# Altium schematic sheet power_mux.SchDoc
size A4; SheetNumber: 8; SheetTotal: 8
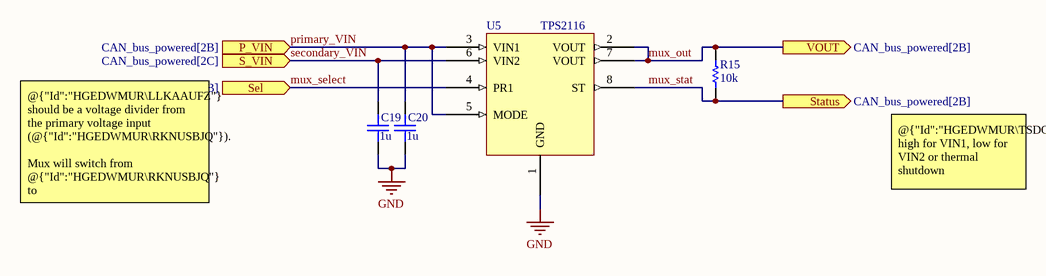
[diagram p0: power_mux.SchDoc]

## Parts
C19  1u
C20  1u
R15  10k
U5  TPS2116

## Ports
P_VIN (in, see CAN_bus_powered[2B]), S_VIN (in, see CAN_bus_powered[2C]), Sel (in, see CAN_bus_powered[2B]), Status (out, see CAN_bus_powered[2B]), VOUT (out, see CAN_bus_powered[2B])

## Nets
GND: C19.1 C20.1 U5.1(GND)
mux_out: R15.2 U5.2(VOUT) U5.7(VOUT) ; port VOUT
mux_select: U5.4(PR1) ; port Sel
mux_stat: R15.1 U5.8(ST) ; port Status
primary_VIN: C20.2 U5.3(VIN1) U5.5(MODE) ; port P_VIN
secondary_VIN: C19.2 U5.6(VIN2) ; port S_VIN

## Notes on the sheet
- @{"Id":"HGEDWMUR\LLKAAUFZ"} should be a voltage divider from the primary voltage input (@{"Id":"HGEDWMUR\RKNUSBJQ"}).
  Mux will switch from @{"Id":"HGEDWMUR\RKNUSBJQ"} to @{"Id":"HGEDWMUR\STDIKBVV"} when the voltage at sel is less than 1V.
- @{"Id":"HGEDWMUR\TSDOJRFR"}: high for VIN1, low for VIN2 or thermal shutdown

## Library data of the parts
C19 C20 = Capacitor
R15 = Resistor
U5 = TPS2116: 1.6 V to 5.5 V, 2.5-A Low IQ Power Mux with Manual and Priority Switchover